# EAGLE schematic emonTx V4.0.2-beta (EAGLE 9.6.2)
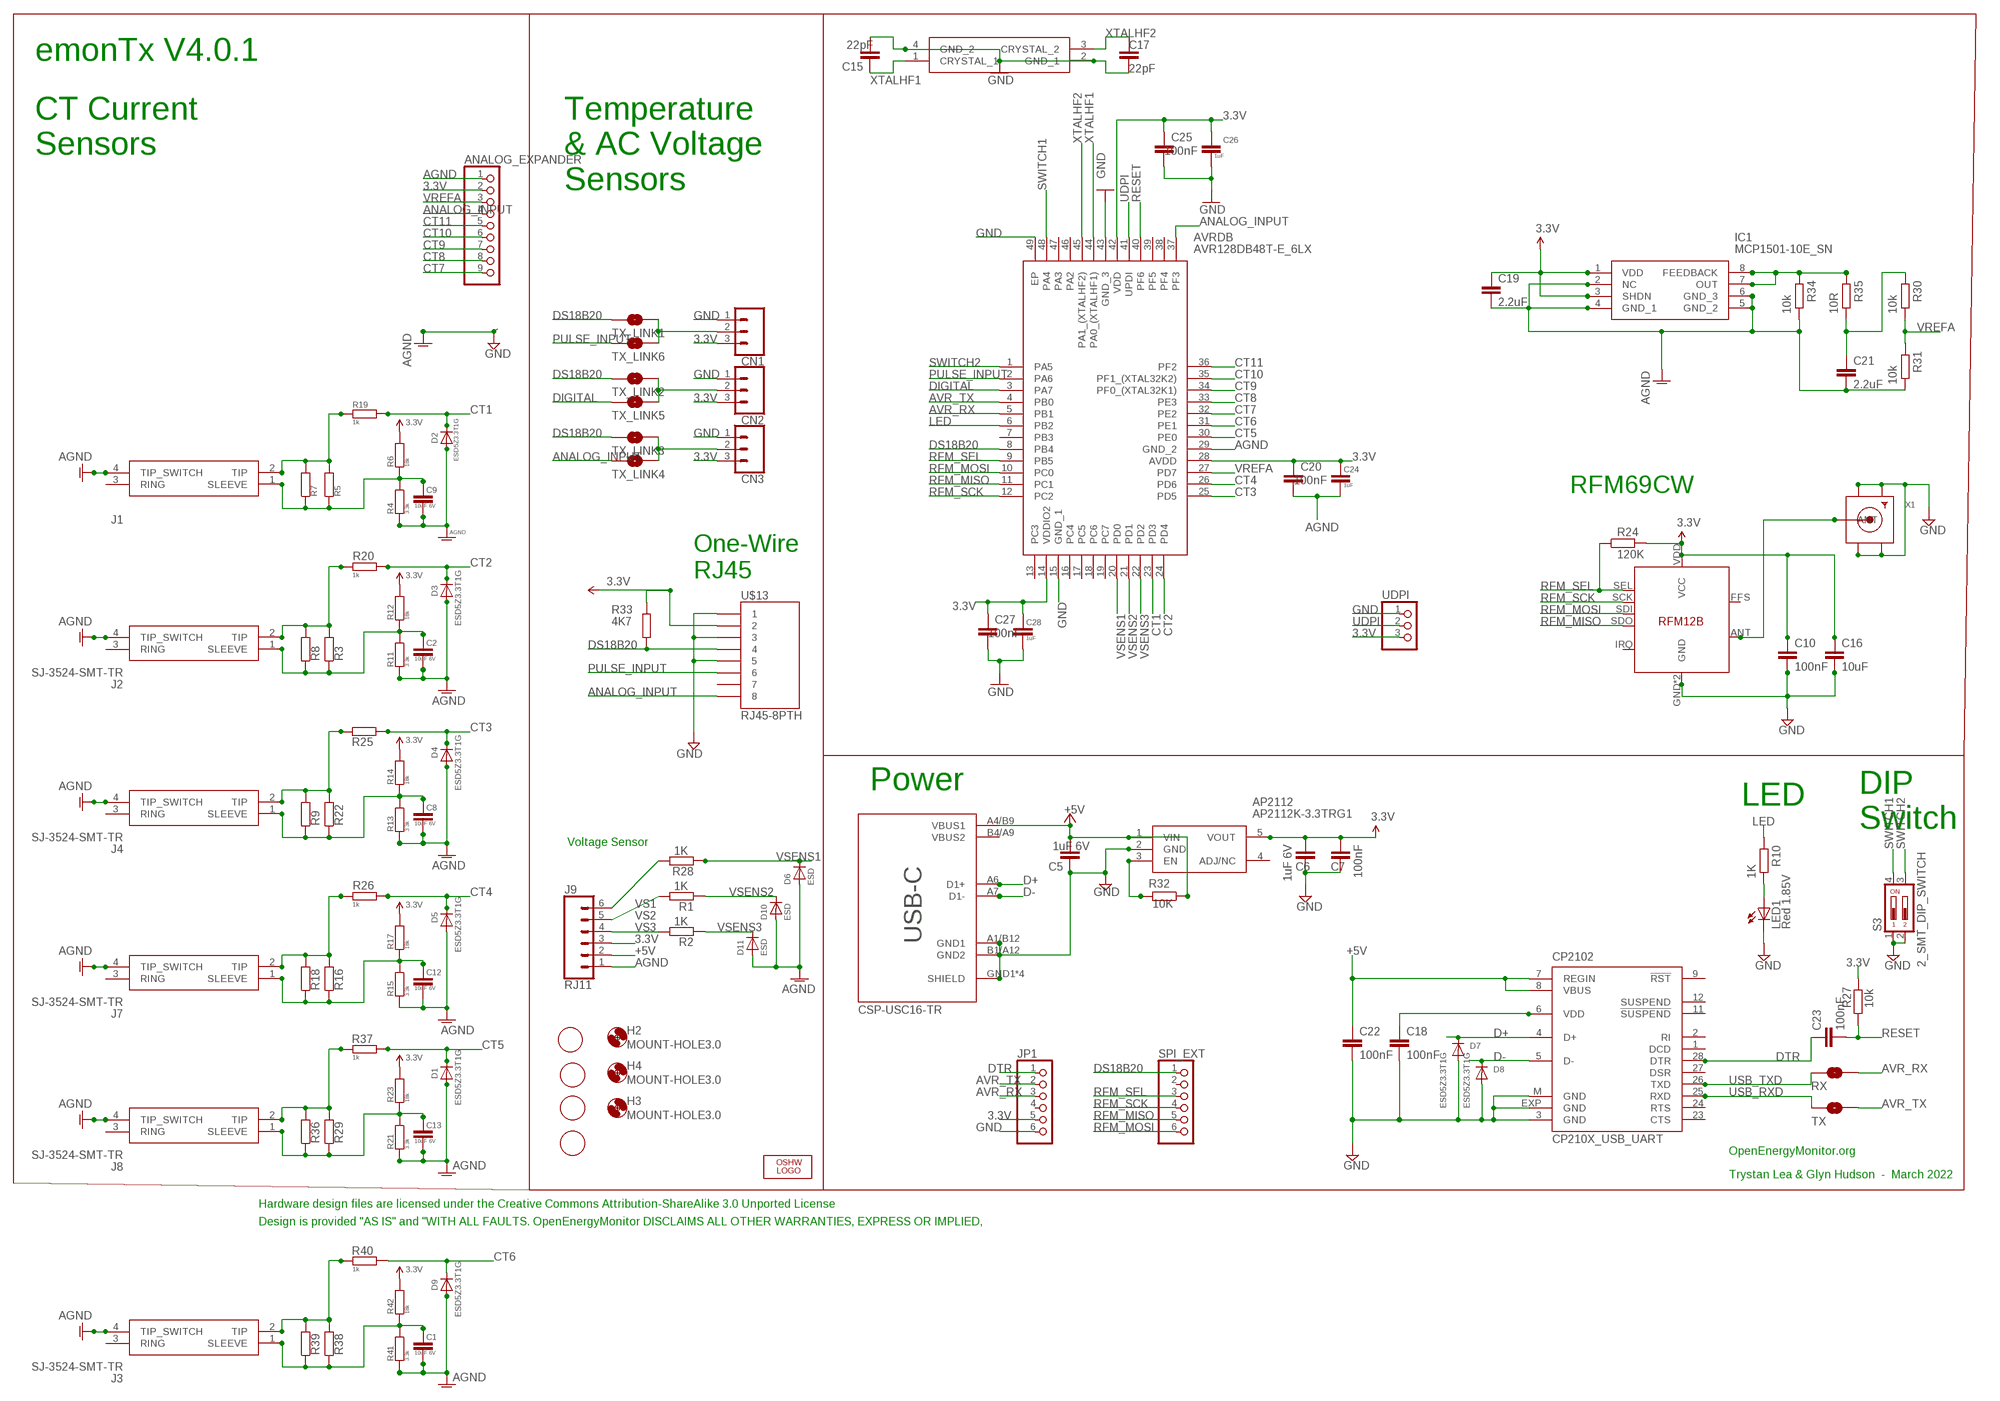
[diagram p0: schematic, sheet 1]

## Parts
ANALOG_EXPANDER  PINHD-1X9  [1X09-BIG]
AP2112  AP2112K-3.3TRG1  [SOT95P282X130-5N]
AVRDB  AVR128DB48T-E_6LX  [QFN40P600X600X90-49N]
C1  10uF 6V  C-EUC0603  [C0603]
C2  10uF 6V  C-EUC0603  [C0603]
C5  1uF 6V  C-EUC0603  [C0603]
C6  1uF 6V  C-EUC0603  [C0603]
C7  100nF  C-EUC0603  [C0603]
C8  10uF 6V  C-EUC0603  [C0603]
C9  10uF 6V  C-EUC0603  [C0603]
C10  100nF  C-EUC0603  [C0603]
C12  10uF 6V  C-EUC0603  [C0603]
C13  10uF 6V  C-EUC0603  [C0603]
C15  22pF  C-EUC0603  [C0603]
C16  10uF  C-EUC0603  [C0603]
C17  22pF  C-EUC0603  [C0603]
C18  100nF  CAP0603-CAP  [0603-CAP]
C19  2.2uF  C-EUC0603  [C0603]
C20  100nF  C-EUC0603  [C0603]
C21  2.2uF  C-EUC0603  [C0603]
C22  100nF  CAP0603-CAP  [0603-CAP]
C23  100nF  C-EUC0603  [C0603]
C24  1uF  C-EUC0603  [C0603]
C25  100nF  C-EUC0603  [C0603]
C26  1uF  C-EUC0603  [C0603]
C27  100nF  C-EUC0603  [C0603]
C28  1uF  C-EUC0603  [C0603]
CN1  CONN_03SCREW  [SCREWTERMINAL-3.5MM-3]
CN2  CONN_03SCREW  [SCREWTERMINAL-3.5MM-3]
CN3  CONN_03SCREW  [SCREWTERMINAL-3.5MM-3]
CP2102  CP210X_USB_UART  [MLP28]
D1  ESD5Z3.3T1G  DIODESOD-523  [SOD-523]
D2  ESD5Z3.3T1G  DIODESOD-523  [SOD-523]
D3  ESD5Z3.3T1G  DIODESOD-523  [SOD-523]
D4  ESD5Z3.3T1G  DIODESOD-523  [SOD-523]
D5  ESD5Z3.3T1G  DIODESOD-523  [SOD-523]
D6  ESD  DIODESOD-523  [SOD-523]
D7  ESD5Z3.3T1G  DIODESOD-523  [SOD-523]
D8  ESD5Z3.3T1G  DIODESOD-523  [SOD-523]
D9  ESD5Z3.3T1G  DIODESOD-523  [SOD-523]
D10  ESD  DIODESOD-523  [SOD-523]
D11  ESD  DIODESOD-523  [SOD-523]
H2  MOUNT-HOLE3.0  [3,0]
H3  MOUNT-HOLE3.0  [3,0]
H4  MOUNT-HOLE3.0  [3,0]
IC1  MCP1501-10E_SN  [SOIC127P600X175-8N]
J1  SJ-3524-SMT-TR  [SJ-3524-SMT-TR]
J2  SJ-3524-SMT-TR  [SJ-3524-SMT-TR]
J3  SJ-3524-SMT-TR  [SJ-3524-SMT-TR]
J4  SJ-3524-SMT-TR  [SJ-3524-SMT-TR]
J7  SJ-3524-SMT-TR  [SJ-3524-SMT-TR]
J8  SJ-3524-SMT-TR  [SJ-3524-SMT-TR]
J9  RJ11  RJ11-6  [RJ11-6]
JP1  PINHD-1X6  [1X06]
LED1  Red 1.85V  LEDCHIP-LED0805  [CHIP-LED0805]
LOGO1  OSHW_LOGO_6MILX0200-NT  [OSHW_6X200_NOTEXT]
R1  1K  R-EU_R0603  [R0603]
R2  1K  R-EU_R0603  [R0603]
R3  R-EU_0204/7  [0204/7]
R4  3.3k  R-EU_R0603  [R0603]
R5  R-EU_0204/7  [0204/7]
R6  18k  R-EU_R0603  [R0603]
R7  R-EU_R1206  [R1206]
R8  R-EU_R1206  [R1206]
R9  R-EU_R1206  [R1206]
R10  1K  R-EU_R0603  [R0603]
R11  3.3k  R-EU_R0603  [R0603]
R12  18k  R-EU_R0603  [R0603]
R13  3.3k  R-EU_R0603  [R0603]
R14  18k  R-EU_R0603  [R0603]
R15  3.3k  R-EU_R0603  [R0603]
R16  R-EU_0204/7  [0204/7]
R17  18k  R-EU_R0603  [R0603]
R18  R-EU_R1206  [R1206]
R19  1k  R-EU_R0603  [R0603]
R20  1k  R-EU_R0603  [R0603]
R21  3.3k  R-EU_R0603  [R0603]
R22  R-EU_0204/7  [0204/7]
R23  18k  R-EU_R0603  [R0603]
R24  120K  R-EU_R0603  [R0603]
R25  1k  R-EU_R0603  [R0603]
R26  1k  R-EU_R0603  [R0603]
R27  10k  R-EU_R0603  [R0603]
R28  1K  R-EU_R0603  [R0603]
R29  R-EU_0204/7  [0204/7]
R30  10k  R-EU_R0603  [R0603]
R31  10k  R-EU_R0603  [R0603]
R32  10K  R-EU_R0603  [R0603]
R33  4K7  R-EU_R0603  [R0603]
R34  10k  R-EU_R0603  [R0603]
R35  10R  R-EU_R0603  [R0603]
R36  R-EU_R1206  [R1206]
R37  1k  R-EU_R0603  [R0603]
R38  R-EU_0204/7  [0204/7]
R39  R-EU_R1206  [R1206]
R40  1k  R-EU_R0603  [R0603]
R41  3.3k  R-EU_R0603  [R0603]
R42  18k  R-EU_R0603  [R0603]
RX  SOLDERJUMPERNC  [SJ_2S]
S3  2_SMT_DIP_SWITCH  [DIP_SWITCH_SMT]
SPI_EXT  PINHD-1X6  [1X06]
TX  SOLDERJUMPERNC  [SJ_2S]
TX_LINK1  SOLDERJUMPERNC  [SJ_2S]
TX_LINK2  SOLDERJUMPERNC  [SJ_2S]
TX_LINK3  SOLDERJUMPERNC  [SJ_2S]
TX_LINK4  SOLDERJUMPERNC  [SJ_2S]
TX_LINK5  SOLDERJUMPERNC  [SJ_2S]
TX_LINK6  SOLDERJUMPERNC  [SJ_2S]
U$1  FIDUCIAL  [FIDUCIAL_1MM]
U$4  FIDUCIAL  [FIDUCIAL_1MM]
U$5  FIDUCIAL  [FIDUCIAL_1MM]
U$7  FIDUCIAL  [FIDUCIAL_1MM]
U$13  RJ45-8PTH  [RJ45-8]
U$14  RFM12B  [RFM12B]
UDPI  PINHD-1X3  [1X03]
USB-C  CSP-USC16-TR  [USB-C]
X1  SMACONNECTOR  [SMA90_DIP]
XTAL  MCSJK-7U-12.00-12-10-80-B-10  [MCSJK7U1200121080B10]

## Nets
3.3V: ANALOG_EXPANDER.2 AP2112.5(VOUT) AVRDB.14(VDDIO2) AVRDB.28(AVDD) AVRDB.42(VDD) C6.2 C7.2 C10.1 C16.1 C19.1 C20.1 C24.1 C25.1 C26.1 C27.1 C28.1 CN1.3 CN2.3 CN3.3 IC1.1(VDD) IC1.3(SHDN) J9.3 JP1.5 R6.2 R12.2 R14.2 R17.2 R23.2 R24.2 R27.2 R33.1 R42.2 U$13.2 U$14.VDD(VCC) UDPI.3
+5V [power]: AP2112.1(VIN) C5.2 C22.1 CP2102.7(REGIN) CP2102.8(VBUS) J9.2 R32.1 USB-C.A4/B9(VBUS1)
AGND [gnd]: ANALOG_EXPANDER.1 AVRDB.29(GND_2) C1.2 C2.2 C8.2 C9.2 C12.2 C13.2 C19.2 C20.2 C21.2 C24.2 D1.A D2.A D3.A D4.A D5.A D6.A D9.A D10.A D11.A IC1.2(NC) IC1.4(GND_1) IC1.5(GND_2) IC1.6(GND_3) J1.4(TIP_SWITCH) J2.4(TIP_SWITCH) J3.4(TIP_SWITCH) J4.4(TIP_SWITCH) J7.4(TIP_SWITCH) J8.4(TIP_SWITCH) J9.1 R4.2 R11.2 R13.2 R15.2 R21.2 R31.1 R34.1 R41.2
ANALOG_INPUT: ANALOG_EXPANDER.4 AVRDB.37(PF3) TX_LINK4.1 U$13.8
AVR_RX: AVRDB.5(PB1) JP1.3 RX.2
AVR_TX: AVRDB.4(PB0) JP1.2 TX.2
CT1: AVRDB.23(PD3) D2.K(C) R19.2
CT2: AVRDB.24(PD4) D3.K(C) R20.2
CT3: AVRDB.25(PD5) D4.K(C) R25.1
CT4: AVRDB.26(PD6) D5.K(C) R26.2
CT5: AVRDB.30(PE0) D1.K(C) R37.2
CT6: AVRDB.31(PE1) D9.K(C) R40.2
CT7: ANALOG_EXPANDER.9 AVRDB.32(PE2)
CT8: ANALOG_EXPANDER.8 AVRDB.33(PE3)
CT9: ANALOG_EXPANDER.7 AVRDB.34(PF0_(XTAL32K1))
CT10: ANALOG_EXPANDER.6 AVRDB.35(PF1_(XTAL32K2))
CT11: ANALOG_EXPANDER.5 AVRDB.36(PF2)
D+: CP2102.4(D+) D7.K(C) USB-C.A6(D1+)
D-: CP2102.5(D-) D8.K(C) USB-C.A7(D1-)
DIG1: U$14.ANT X1.ANTENNA(ANT)
DIGITAL: AVRDB.3(PA7) TX_LINK5.1
DS18B20: AVRDB.8(PB4) R33.2 SPI_EXT.1 TX_LINK1.1 TX_LINK2.1 TX_LINK3.1 U$13.4
DTR: C23.1 CP2102.28(DTR) JP1.1
GND [gnd]: AP2112.2(GND) AVRDB.15(GND_1) AVRDB.43(GND_3) AVRDB.49(EP) C5.1 C6.1 C7.1 C10.2 C15.2 C16.2 C17.2 C18.2 C22.2 C25.2 C26.2 C27.2 C28.2 CN1.1 CN2.1 CN3.1 CP2102.3(GND) CP2102.EXP(GND) CP2102.M(GND) D7.A D8.A JP1.6 LED1.C S3.1 S3.2 U$13.1 U$13.3 U$13.5 U$14.GND U$14.P$12(GND) UDPI.1 USB-C.A1/B12(GND1) USB-C.B1/A12(GND2) USB-C.GND1(SHIELD) USB-C.GND2(SHIELD) USB-C.GND3(SHIELD) USB-C.GND4(SHIELD) X1.GND1 X1.GND2 X1.GND3 X1.GND4 XTAL.2(GND_1) XTAL.4(GND_2) ; supply symbol labelled AGND
LED: AVRDB.6(PB2) R10.2
N$1: AP2112.3(EN) R32.2
N$2: J3.2(TIP) R38.2 R39.2 R40.1
N$3: J4.2(TIP) R9.2 R22.2 R25.2
N$4: C18.1 CP2102.6(VDD)
N$5: C1.1 J3.1(SLEEVE) R38.1 R39.1 R41.1 R42.1
N$6: C21.1 R30.2 R35.1
N$8: J7.2(TIP) R16.2 R18.2 R26.1
N$10: J1.2(TIP) R5.2 R7.2 R19.1
N$11: C9.1 J1.1(SLEEVE) R4.1 R5.1 R6.1 R7.1
N$12: J8.2(TIP) R29.2 R36.2 R37.1
N$13: J2.2(TIP) R3.2 R8.2 R20.1
N$18: CN1.2 TX_LINK1.2 TX_LINK6.2
N$19: CN2.2 TX_LINK2.2 TX_LINK5.2
N$21: CN3.2 TX_LINK3.2 TX_LINK4.2
N$24: C2.1 J2.1(SLEEVE) R3.1 R8.1 R11.1 R12.1
N$25: C8.1 J4.1(SLEEVE) R9.1 R13.1 R14.1 R22.1
N$26: C12.1 J7.1(SLEEVE) R15.1 R16.1 R17.1 R18.1
N$27: IC1.7(OUT) IC1.8(FEEDBACK) R34.2 R35.2
N$28: C13.1 J8.1(SLEEVE) R21.1 R23.1 R29.1 R36.1
N$41: LED1.A R10.1
PULSE_INPUT: AVRDB.2(PA6) TX_LINK6.1 U$13.6
RESET: AVRDB.40(PF6) C23.2 R27.1
RFM_MISO: AVRDB.11(PC1) SPI_EXT.5 U$14.SDO
RFM_MOSI: AVRDB.10(PC0) SPI_EXT.6 U$14.SDI
RFM_SCK: AVRDB.12(PC2) SPI_EXT.4 U$14.SCK
RFM_SEL: AVRDB.9(PB5) R24.1 SPI_EXT.3 U$14.SEL
SWITCH1: AVRDB.48(PA4) S3.4
SWITCH2: AVRDB.1(PA5) S3.3
UDPI: AVRDB.41(UPDI) UDPI.2
USB_RXD: CP2102.25(RXD) TX.1
USB_TXD: CP2102.26(TXD) RX.1
VREFA: ANALOG_EXPANDER.3 AVRDB.27(PD7) R30.1 R31.2
VS1: J9.6 R28.2
VS2: J9.5 R1.2
VS3: J9.4 R2.2
VSENS1: AVRDB.20(PD0) D6.K(C) R28.1
VSENS2: AVRDB.21(PD1) D10.K(C) R1.1
VSENS3: AVRDB.22(PD2) D11.K(C) R2.1
XTALHF1: AVRDB.44(PA0_(XTALHF1)) C15.1 XTAL.1(CRYSTAL_1)
XTALHF2: AVRDB.45(PA1_(XTALHF2)) C17.1 XTAL.3(CRYSTAL_2)
Unconnected: AP2112.4(ADJ/NC) AVRDB.7(PB3) AVRDB.13(PC3) AVRDB.16(PC4) AVRDB.17(PC5) AVRDB.18(PC6) AVRDB.19(PC7) AVRDB.38(PF4) AVRDB.39(PF5) AVRDB.46(PA2) AVRDB.47(PA3) CP2102.1(DCD) CP2102.2(RI) CP2102.9(!RST) CP2102.11(!SUSPEND) CP2102.12(SUSPEND) CP2102.23(CTS) CP2102.24(RTS) CP2102.27(DSR) J1.3(RING) J2.3(RING) J3.3(RING) J4.3(RING) J7.3(RING) J8.3(RING) JP1.4 SPI_EXT.2 U$13.7 U$14.FFS U$14.IRQ USB-C.B4/A9(VBUS2)

## Notes on the sheet
- emonTx V4.0.1
- CT Current 
  Sensors
- Temperature 
  & AC Voltage
  Sensors
- RFM69CW
- One-Wire
  RJ45
- Power
- LED
- DIP
  Switch
- Voltage Sensor
- OpenEnergyMonitor.org
- Trystan Lea & Glyn Hudson  -  March 2022
- Hardware design files are licensed under the Creative Commons Attribution-ShareAlike 3.0 Unported License
- Design is provided "AS IS" and "WITH ALL FAULTS. OpenEnergyMonitor DISCLAIMS ALL OTHER WARRANTIES, EXPRESS OR IMPLIED,

## Library data of the parts
ANALOG_EXPANDER = adafruit:PINHD-1X9: Pin header 1x10 0.1" spacing With round pins
AP2112 = AP2112K-3.3TRG1:AP2112K-3.3TRG1: 600mA 3.3V LDO Regulator Enable SOT23-5 DiodesZetex AP2112K-3.3TRG1, LDO Voltage Regulator, 3.3 V +/-1.5%, 2.5 6 Vin, 5-Pin SOT-23 Source: Datasheet <http://uk.rs-online.com/web/p/products/8283509>; ARROW_PART_NUMBER: AP2112K-3.3TRG1; ARROW_PRICE-STOCK: https://www.arrow.com/en/products/ap2112k-3.3trg1/diodes-incorporated?region=nac; DESCRIPTION: 600mA 3.3V LDO Regulator Enable SOT23-5 DiodesZetex AP2112K-3.3TRG1, LDO Voltage Regulator, 3.3 V +/-1.5%, 2.5 6 Vin, 5-Pin SOT-23; HEIGHT: 1.3mm; MANUFACTURER_NAME: Diodes Inc.; MANUFACTURER_PART_NUMBER: AP2112K-3.3TRG1; MOUSER_PART_NUMBER: 621-AP2112K-3.3TRG1; MOUSER_PRICE-STOCK: https://www.mouser.co.uk/ProductDetail/Diodes-Incorporated/AP2112K-33TRG1?qs=x6A8l6qLYDDPYHosCdzh%2FA%3D%3D
AVRDB = AVR128DB48T-E_6LX:AVR128DB48T-E_6LX: IC MCU 8BIT 128KB FLASH 48VQFN Source: Datasheet <https://4donline.ihs.com/images/VipMasterIC/IC/MCHP/MCHP-S-A0010410415/MCHP-S-A0011111973-1.pdf?hkey=6D3A4C79FDBF58556ACFDE234799DDF0>; DESCRIPTION: IC MCU 8BIT 128KB FLASH 48VQFN; HEIGHT: 0.9mm; MANUFACTURER_NAME: Microchip; MANUFACTURER_PART_NUMBER: AVR128DB48T-E/6LX; MOUSER_PART_NUMBER: 579-VR128DB48T-E/6LX; MOUSER_PRICE-STOCK: https://www.mouser.co.uk/ProductDetail/Microchip-Technology/AVR128DB48T-E-6LX?qs=vmHwEFxEFR%252BvecSHjxOfmQ%3D%3D
C1 C2 C5-C9 C12 C13 C15 C17 C20 C24-C28 = resistor:C-EU: CAPACITOR, European symbol
C10 C16 C19 C21 C23 = rcl:C-EU: CAPACITOR, European symbol
C18 C22 = SparkFun:CAP: Capacitor Standard 0603 ceramic capacitor, and 0.1" leaded capacitor.
CN1-CN3 = SparkFun-Connectors:CONN_03: Multi connection point. Often used as Generic Header-pin footprint for 0.1 inch spaced/style header connections On any of the 0.1 inch spaced packages, you can populate with these: Break Away Headers - Straight <https://www.sparkfun.com/products/116> (PRT-00116) Break Away Male Headers - Right Angle <https://www.sparkfun.com/products/553> (PRT-00553) Female Headers <https://www.sparkfun.com/products/115> (PRT-00115) Break Away Headers - Machine Pin <https://www.sparkfun.com/products/117> (PRT-00117) Break Away Female Headers - Swiss Machine Pin <https://www.sparkfun.com/products/743> (PRT-00743) Stackable Header - 3 Pin (Female, 0.1") <https://www.sparkfun.com/products/13875> (PRT-13875) For SCREWTERMINALS and SPRING TERMINALS visit here: Screw Terimnals on SparkFun.com <https://www.sparkfun.com/search/results?term=Screw+Terminals> (5mm/3.5mm/2.54mm spacing) This device is also useful as a general connection point to wire up your design to another part of your project. Our various solder wires solder well into these plated through hole pads. Hook-Up Wire - Assortment (Stranded, 22 AWG) <https://www.sparkfun.com/products/11375> (PRT-11375) Hook-Up Wire - Assortment (Solid Core, 22 AWG) <https://www.sparkfun.com/products/11367> (PRT-11367) View the entire wire category on our website here <https://www.sparkfun.com/categories/141> Special notes: Molex polarized connector foot print use with SKU : PRT-08232 with associated crimp pins and housings.; PROD_ID: CONN-08288; SF_ID: PRT-08235
CP2102 = SparkFun-DigitalIC:CP210X_USB_UART: Single-Chip USB to UART Bridge Source: www.silabs.com .. CP2101.pdf / cp2102.pdf. Spark Fun Electronics SKU : COM-00310
D1-D11 = microbuilder:DIODE: Diode SMA Model Volts Amps Type Vf Vr Digikey # Notes SSA34-E3 40V 3A Schottky 480mV @ 3A 200uA @ 40V SSA34-E3/61TGITR-ND CDBA120-G 20V 1A Schottky 500mV @ 1A 500uA @ 20V 641-1014-6-ND REEL MBRA210 10V 2A Schottky 350mV @ 2A 700uA @ 10V MBRA210LT3 SOD-123 Model Volts Amps Type Vf Vr Order # Notes BAT54T1G 30V 200mA Schottky 800mV @ 200mA 2uA @ 25V BAT54T1GOSTR-ND B0530W 30V 500mA Schottky 430mV @ 500mA 130uA @ 30V B0530W-FDICT-ND REEL MBR120 1A 20V Schottky 340mV @ 1A MBR120VLSFT1GOSCT-ND SOD-323 Model Volts Amps Type Vf Vr Order # Notes PMEG2005EJ 20V 500mA Schottky 355mV @ 500mA 568-4110-1-ND ZLLS410 10V 570mA Schottky 380mV @ 570mA ZLLS410CT-ND 1N4148WS 75V 150mA Silicon/Simple 1V 1N4148WSFSCT-ND REEL SOD-523 Model Volts Amps Type Vf Vr Order # Notes BAT54XV2 30V 200mA Schottky 0.8V @ 100mA BAT54XV2CT-ND TB751S 30V 30mA Schottky RB751S-40TE61CT-ND SOT23-R/W (R = Solder Paste/Reflow Ovens, W = Hand-Soldering) Model Volts Amps Type Vf Vr Order # Notes BAT54FILM 40V 300mA Schottky 497-7162-1-ND
H2-H4 = holes:MOUNT-HOLE: MOUNTING HOLE with drill center marker
IC1 = MCP1501-10E_SN:MCP1501-10E_SN: MICROCHIP - MCP1501-10E/SN - VOLTAGE REF, SERIES, 1.024V, NSOIC-8 Source: Datasheet <http://www.farnell.com/datasheets/2015662.pdf>; ARROW_PART_NUMBER: MCP1501-10E/SN; ARROW_PRICE-STOCK: https://www.arrow.com/en/products/mcp1501-10esn/microchip-technology; DESCRIPTION: MICROCHIP - MCP1501-10E/SN - VOLTAGE REF, SERIES, 1.024V, NSOIC-8; HEIGHT: 1.75mm; MANUFACTURER_NAME: Microchip; MANUFACTURER_PART_NUMBER: MCP1501-10E/SN; MOUSER_PART_NUMBER: 579-MCP1501-10E/SN; MOUSER_PRICE-STOCK: https://www.mouser.co.uk/ProductDetail/Microchip-Technology/MCP1501-10E-SN?qs=BA62vJVifGrukY%252BvRXgfwQ%3D%3D
J1-J4 J7 J8 = SJ-3524-SMT-TR:SJ-3524-SMT-TR: Phone Connectors Audio Jacks Source: Datasheet <https://datasheet.datasheetarchive.com/originals/distributors/Datasheets-DGA1/151896.pdf>; ARROW_PART_NUMBER: SJ-3524-SMT-TR; ARROW_PRICE-STOCK: https://www.arrow.com/en/products/sj-3524-smt-tr/cui-devices?region=nac; DESCRIPTION: Phone Connectors Audio Jacks; HEIGHT: mm; MANUFACTURER_NAME: CUI Inc.; MANUFACTURER_PART_NUMBER: SJ-3524-SMT-TR; MOUSER_PART_NUMBER: 490-SJ-3524-SMT-TR; MOUSER_PRICE-STOCK: https://www.mouser.co.uk/ProductDetail/CUI-Devices/SJ-3524-SMT-TR?qs=WyjlAZoYn50%252B7OcNbxvx%252BA%3D%3D
J9 = SparkFun-Connectors:RJ11-6: RJ11 Jack - 6 pin Commonly found on CAT3 devices and some Microchip programmers. Here is the connector we sell at SparkFun: RJ11 6-Pin Connector <https://www.sparkfun.com/products/132> (PRT-00132) Datasheet <http://www.sparkfun.com/datasheets/Prototyping/Connectors/RJ11-Datasheet.pdf> It is used on this SparkFun product: SparkFun Weather Shield <https://www.sparkfun.com/products/12081> (DEV-12081) Weather Meters <https://www.sparkfun.com/products/8942> (SEN-08942); PROD_ID: CONN-08590; SF_ID: PRT-00132
JP1 SPI_EXT = adafruit:PINHD-1X6: PIN HEADER
LED1 = adafruit:LED: LED OSRAM: - CHIPLED LG R971, LG N971, LY N971, LG Q971, LY Q971, LO R971, LY R971 LH N974, LH R974 LS Q976, LO Q976, LY Q976 LO Q996 - Hyper CHIPLED LW Q18S LB Q993, LB Q99A, LB R99A - SideLED LS A670, LO A670, LY A670, LG A670, LP A670 LB A673, LV A673, LT A673, LW A673 LH A674 LY A675 LS A676, LA A676, LO A676, LY A676, LW A676 LS A679, LY A679, LG A679 - Hyper Micro SIDELED® LS Y876, LA Y876, LO Y876, LY Y876 LT Y87S - SmartLED LW L88C, LW L88S LB L89C, LB L89S, LG L890 LS L89K, LO L89K, LY L89K LS L896, LA L896, LO L896, LY L896 - TOPLED LS T670, LO T670, LY T670, LG T670, LP T670 LSG T670, LSP T670, LSY T670, LOP T670, LYG T670 LG T671, LOG T671, LSG T671 LB T673, LV T673, LT T673, LW T673 LH T674 LS T676, LA T676, LO T676, LY T676, LB T676, LH T676, LSB T676, LW T676 LB T67C, LV T67C, LT T67C, LS T67K, LO T67K, LY T67K, LW E67C LS E67B, LA E67B, LO E67B, LY E67B, LB E67C, LV E67C, LT E67C LW T67C LS T679, LY T679, LG T679 LS T770, LO T770, LY T770, LG T770, LP T770 LB T773, LV T773, LT T773, LW T773 LH T774 LS E675, LA E675, LY E675, LS T675 LS T776, LA T776, LO T776, LY T776, LB T776 LHGB T686 LT T68C, LB T68C - Hyper Mini TOPLED® LB M676 - Mini TOPLED Santana® LG M470 LS M47K, LO M47K, LY M47K Source: http://www.osram.convergy.de/
LOGO1 = ohw-logo:OSHW_LOGO_6MIL
R1-R42 = rcl:R-EU_: RESISTOR, European symbol
RX TX TX_LINK1-TX_LINK6 = SparkFun:SOLDERJUMPER: Solder Jumper Standard SMD solder jumper. Used to automate production. Two varients : Normally Open and Normally Closed are the same, but have different paste layers. NC will have a large amount of paste and should jumper during reflow.
S3 = OpenEnergyMonitor:2_SMT_DIP_SWITCH: Multicomp MCEMR-02-T 2 throw SMT DIP switch, Farnell 1524005
U$1 U$4 U$5 U$7 = adafruit:FIDUCIAL: For use by pick and place machines to calibrate the vision/machine, 1mm By microbuilder.eu
U$13 = SparkFun-Connectors:RJ45-8: RJ45 Jack Simple RJ45, 8-pin connection - connector for common Cat5, Cat5e, and Cat6 Ethernet cables. Footprint not yet proven in production. Connector sku is PRT-00643; Breakout PCB sku is BOB-00716.
U$14 = JeeParts:RFM12B
UDPI = adafruit:PINHD-1X3: PIN HEADER
USB-C = CSP-USC16-TR:CSP-USC16-TR: CSP-USC16-TR TOBY.CO.UK; MPN: CSP-USC16-TR
X1 = adafruit:SMACONNECTOR: SMA Connector 90° DIP SMA Connector, 50 Ohm (4UConnector: 07259)
XTAL = MCSJK-7U-12.00-12-10-80-B-10:MCSJK-7U-12.00-12-10-80-B-10: CRYSTAL, 12MHZ, 12PF, 3.2MM X 2.5MM Source: Datasheet <https://componentsearchengine.com/Datasheets/2/MCSJK-7U-12.00-12-10-80-B-10.pdf>; DESCRIPTION: CRYSTAL, 12MHZ, 12PF, 3.2MM X 2.5MM; HEIGHT: 0.8mm; MANUFACTURER_NAME: MULTICOMP; MANUFACTURER_PART_NUMBER: MCSJK-7U-12.00-12-10-80-B-10

## Net classes
0 default: width 0.203 mm, drill 0.6 mm, clearance 0.203 mm
1 power: width 0.305 mm, drill 0.6 mm, clearance 0.254 mm
2 gnd: width 0.254 mm, drill 0.6 mm, clearance 0.254 mm